# Altium schematic sheet LiPo_1S_Protection_Circuit.SchDoc
size A4
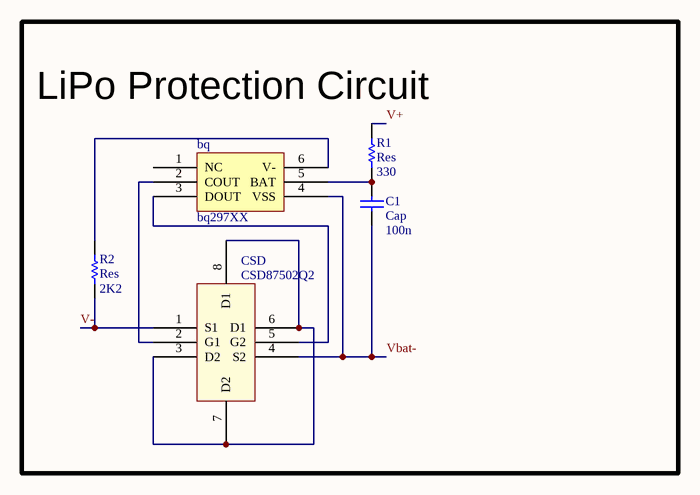
[diagram p0: LiPo_1S_Protection_Circuit.SchDoc]

## Parts
bq  bq297XX  [bq297xx]
C1  Cap  value 100n  [0603 Cap]
CSD  CSD87502Q2  [CSD87502Q2]
R1  Res  value 330  [0603 Res]
R2  Res  value 2K2  [0603 Res]

## Blocks framed on the sheet
LiPo Protection Circuit: bq C1 CSD R1 R2

## Nets
V+: R1.2
V-: CSD.1(S1) R2.1
Vbat-: bq.4(VSS) C1.1 CSD.4(S2)
Netbq_2: bq.2(COUT) CSD.2(G1)
Netbq_3: bq.3(DOUT) CSD.5(G2)
Netbq_5: bq.5(BAT) C1.2 R1.1
Netbq_6: bq.6(V-) R2.2
NetCSD_3: CSD.3(D2) CSD.6(D1) CSD.7(D2) CSD.8(D1)

Not connected (* = marked no-connect by the designer): bq 1(NC)